# EAGLE design ServoShield_v2 (EAGLE 7.5.0)
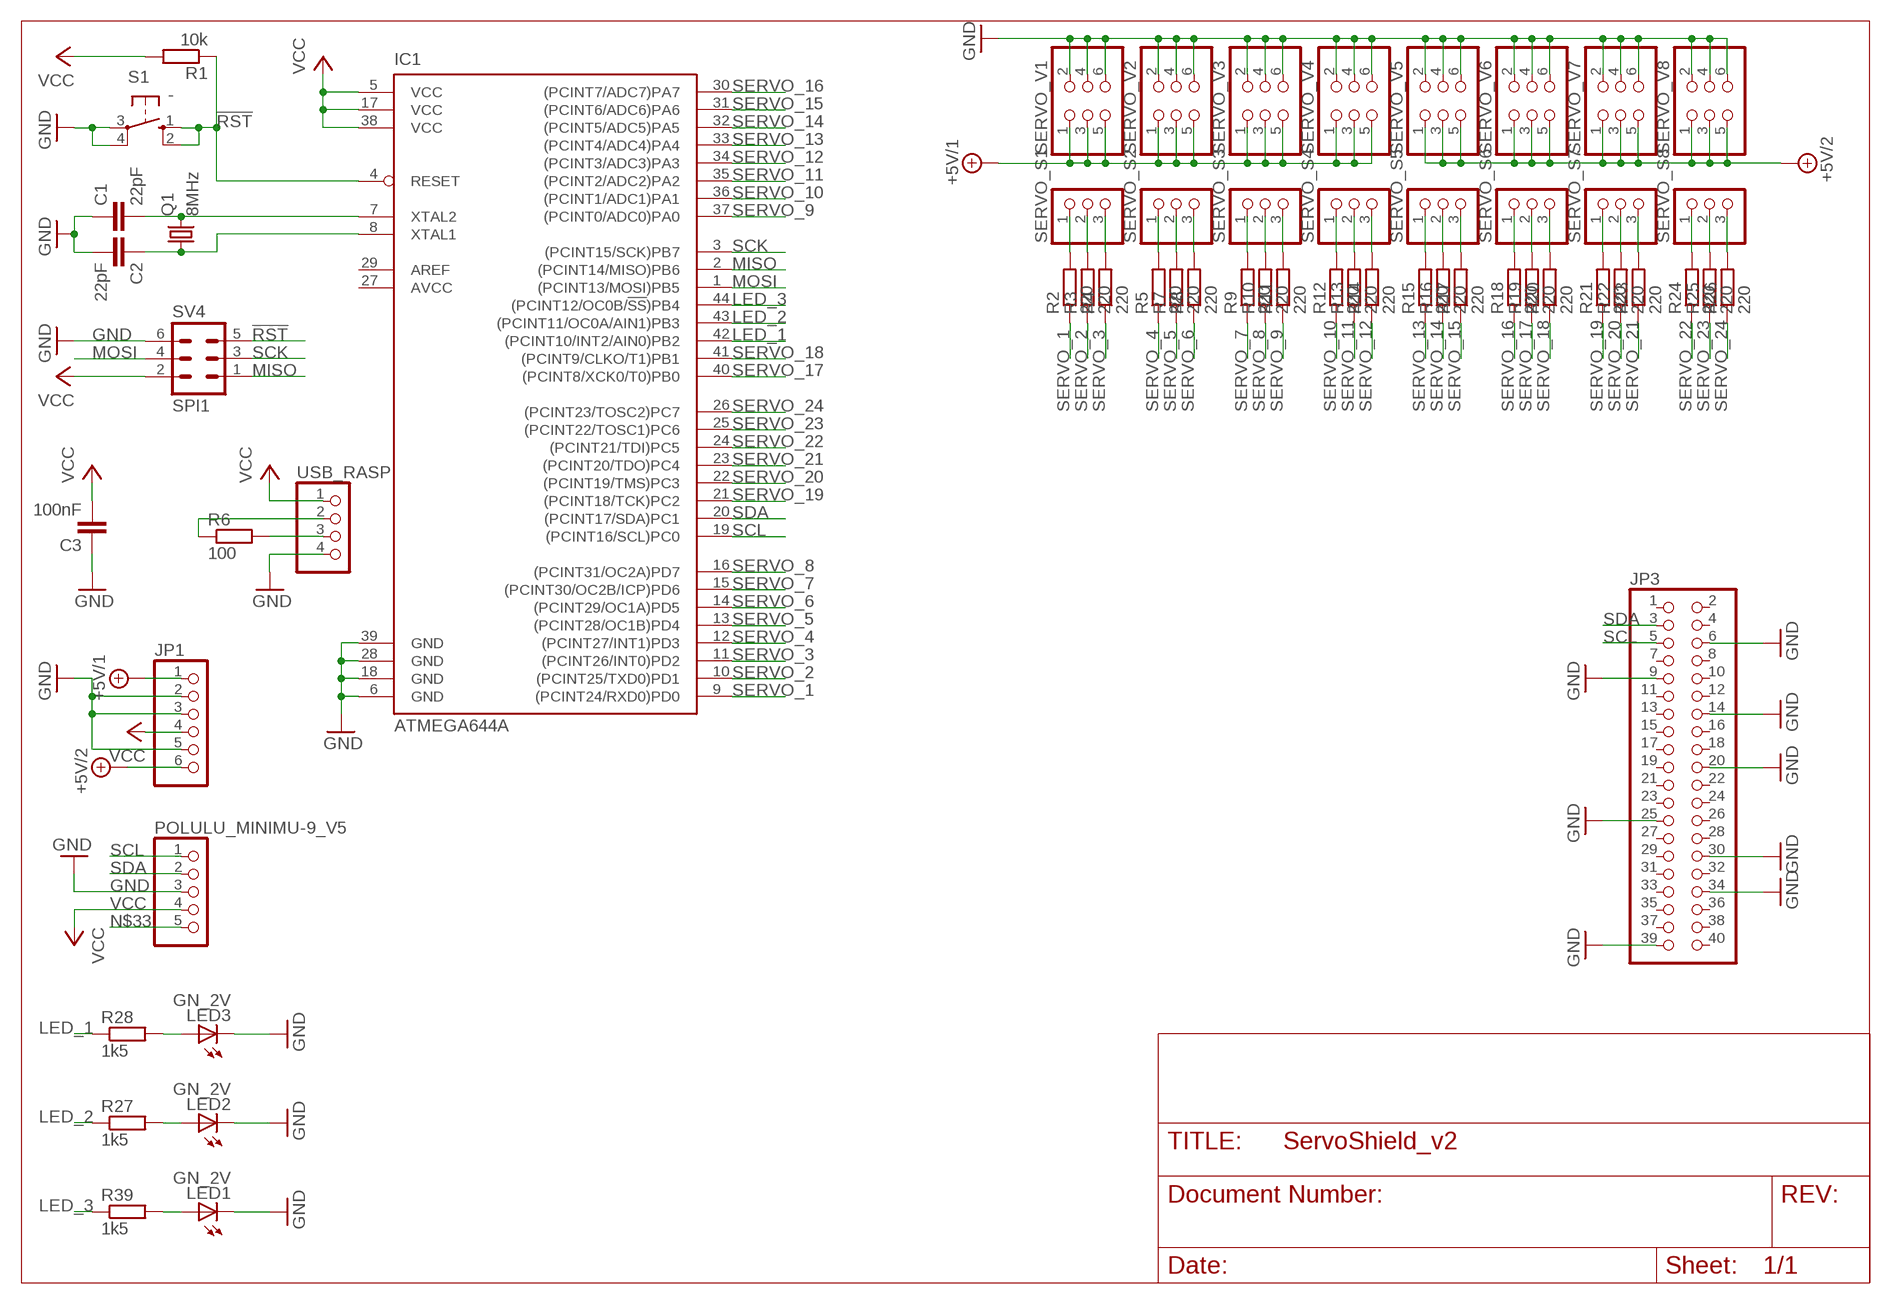
[diagram p0: schematic, sheet 1]

## Parts
C1  22pF  C-EUC0805  [C0805]
C2  22pF  C-EUC0805  [C0805]
C3  100nF  C-EUC0805  [C0805]
IC1  ATMEGA644A  [TQFP44]
JP1  PINHD-1X6  [1X06]
JP3  PINHD-2X20  [2X20]
LED1  GN_2V  LED3MM  [LED3MM]
LED2  GN_2V  LED3MM  [LED3MM]
LED3  GN_2V  LED3MM  [LED3MM]
POLULU_MINIMU-9_V5  PINHD-1X5  [1X05]
Q1  8MHz  CRYSTALCTS406  [CTS406]
R1  10k  R-EU_R0805  [R0805]
R2  220  R-EU_R0805  [R0805]
R3  220  R-EU_R0805  [R0805]
R4  220  R-EU_R0805  [R0805]
R5  220  R-EU_R0805  [R0805]
R6  100  R-EU_R0805  [R0805]
R7  220  R-EU_R0805  [R0805]
R8  220  R-EU_R0805  [R0805]
R9  220  R-EU_R0805  [R0805]
R10  220  R-EU_R0805  [R0805]
R11  220  R-EU_R0805  [R0805]
R12  220  R-EU_R0805  [R0805]
R13  220  R-EU_R0805  [R0805]
R14  220  R-EU_R0805  [R0805]
R15  220  R-EU_R0805  [R0805]
R16  220  R-EU_R0805  [R0805]
R17  220  R-EU_R0805  [R0805]
R18  220  R-EU_R0805  [R0805]
R19  220  R-EU_R0805  [R0805]
R20  220  R-EU_R0805  [R0805]
R21  220  R-EU_R0805  [R0805]
R22  220  R-EU_R0805  [R0805]
R23  220  R-EU_R0805  [R0805]
R24  220  R-EU_R0805  [R0805]
R25  220  R-EU_R0805  [R0805]
R26  220  R-EU_R0805  [R0805]
R27  1k5  R-EU_R0805  [R0805]
R28  1k5  R-EU_R0805  [R0805]
R39  1k5  R-EU_R0805  [R0805]
S1  -  10-XX  [B3F-10XX]
SERVO_S1  PINHD-1X3  [1X03]
SERVO_S2  PINHD-1X3  [1X03]
SERVO_S3  PINHD-1X3  [1X03]
SERVO_S4  PINHD-1X3  [1X03]
SERVO_S5  PINHD-1X3  [1X03]
SERVO_S6  PINHD-1X3  [1X03]
SERVO_S7  PINHD-1X3  [1X03]
SERVO_S8  PINHD-1X3  [1X03]
SERVO_V1  PINHD-2X3  [2X03]
SERVO_V2  PINHD-2X3  [2X03]
SERVO_V3  PINHD-2X3  [2X03]
SERVO_V4  PINHD-2X3  [2X03]
SERVO_V5  PINHD-2X3  [2X03]
SERVO_V6  PINHD-2X3  [2X03]
SERVO_V7  PINHD-2X3  [2X03]
SERVO_V8  PINHD-2X3  [2X03]
SV4  SPI1  ML6  [ML6]
USB_RASP  PINHD-1X4  [1X04]

## Nets
!RST: IC1.4(RESET) R1.1 S1.1(S) S1.2(S1) SV4.5
+5V/1: JP1.1 SERVO_V1.1 SERVO_V1.3 SERVO_V1.5 SERVO_V2.1 SERVO_V2.3 SERVO_V2.5 SERVO_V3.1 SERVO_V3.3 SERVO_V3.5 SERVO_V4.1 SERVO_V4.3 SERVO_V4.5
+5V/2: JP1.6 SERVO_V5.1 SERVO_V5.3 SERVO_V5.5 SERVO_V6.1 SERVO_V6.3 SERVO_V6.5 SERVO_V7.1 SERVO_V7.3 SERVO_V7.5 SERVO_V8.1 SERVO_V8.3 SERVO_V8.5
GND: C1.1 C2.2 C3.1 IC1.6(GND) IC1.18(GND) IC1.28(GND) IC1.39(GND) JP1.2 JP1.3 JP1.5 JP3.6 JP3.9 JP3.14 JP3.20 JP3.25 JP3.30 JP3.34 JP3.39 LED1.K(C) LED2.K(C) LED3.K(C) POLULU_MINIMU-9_V5.3 S1.3(P) S1.4(P1) SERVO_V1.2 SERVO_V1.4 SERVO_V1.6 SERVO_V2.2 SERVO_V2.4 SERVO_V2.6 SERVO_V3.2 SERVO_V3.4 SERVO_V3.6 SERVO_V4.2 SERVO_V4.4 SERVO_V4.6 SERVO_V5.2 SERVO_V5.4 SERVO_V5.6 SERVO_V6.2 SERVO_V6.4 SERVO_V6.6 SERVO_V7.2 SERVO_V7.4 SERVO_V7.6 SERVO_V8.2 SERVO_V8.4 SERVO_V8.6 SV4.6 USB_RASP.4
LED_1: IC1.42((PCINT10/INT2/AIN0)PB2) R28.1
LED_2: IC1.43((PCINT11/OC0A/AIN1)PB3) R27.1
LED_3: IC1.44((PCINT12/OC0B/!SS!)PB4) R39.1
MISO: IC1.2((PCINT14/MISO)PB6) SV4.1
MOSI: IC1.1((PCINT13/MOSI)PB5) SV4.4
N$1: C2.1 IC1.8(XTAL1) Q1.1
N$2: C1.2 IC1.7(XTAL2) Q1.3
N$3: R2.2 SERVO_S1.1
N$4: R3.2 SERVO_S1.2
N$5: R4.2 SERVO_S1.3
N$6: R5.2 SERVO_S2.1
N$7: R7.2 SERVO_S2.2
N$8: R8.2 SERVO_S2.3
N$9: R9.2 SERVO_S3.1
N$10: R10.2 SERVO_S3.2
N$11: R11.2 SERVO_S3.3
N$12: R12.2 SERVO_S4.1
N$13: R13.2 SERVO_S4.2
N$14: R14.2 SERVO_S4.3
N$15: R15.2 SERVO_S5.1
N$16: R16.2 SERVO_S5.2
N$17: R17.2 SERVO_S5.3
N$18: R18.2 SERVO_S6.1
N$19: R19.2 SERVO_S6.2
N$20: R20.2 SERVO_S6.3
N$21: R21.2 SERVO_S7.1
N$22: R22.2 SERVO_S7.2
N$23: R23.2 SERVO_S7.3
N$24: R24.2 SERVO_S8.1
N$25: R25.2 SERVO_S8.2
N$26: R26.2 SERVO_S8.3
N$27: LED2.A R27.2
N$28: LED3.A R28.2
N$33: POLULU_MINIMU-9_V5.5
N$84: R6.2 USB_RASP.3
N$85: LED1.A R39.2
N$86: R6.1 USB_RASP.2
SCK: IC1.3((PCINT15/SCK)PB7) SV4.3
SCL: IC1.19((PCINT16/SCL)PC0) JP3.5 POLULU_MINIMU-9_V5.1
SDA: IC1.20((PCINT17/SDA)PC1) JP3.3 POLULU_MINIMU-9_V5.2
SERVO_1: IC1.9((PCINT24/RXD0)PD0) R2.1
SERVO_2: IC1.10((PCINT25/TXD0)PD1) R3.1
SERVO_3: IC1.11((PCINT26/INT0)PD2) R4.1
SERVO_4: IC1.12((PCINT27/INT1)PD3) R5.1
SERVO_5: IC1.13((PCINT28/OC1B)PD4) R7.1
SERVO_6: IC1.14((PCINT29/OC1A)PD5) R8.1
SERVO_7: IC1.15((PCINT30/OC2B/ICP)PD6) R9.1
SERVO_8: IC1.16((PCINT31/OC2A)PD7) R10.1
SERVO_9: IC1.37((PCINT0/ADC0)PA0) R11.1
SERVO_10: IC1.36((PCINT1/ADC1)PA1) R12.1
SERVO_11: IC1.35((PCINT2/ADC2)PA2) R13.1
SERVO_12: IC1.34((PCINT3/ADC3)PA3) R14.1
SERVO_13: IC1.33((PCINT4/ADC4)PA4) R15.1
SERVO_14: IC1.32((PCINT5/ADC5)PA5) R16.1
SERVO_15: IC1.31((PCINT6/ADC6)PA6) R17.1
SERVO_16: IC1.30((PCINT7/ADC7)PA7) R18.1
SERVO_17: IC1.40((PCINT8/XCK0/T0)PB0) R19.1
SERVO_18: IC1.41((PCINT9/CLKO/T1)PB1) R20.1
SERVO_19: IC1.21((PCINT18/TCK)PC2) R21.1
SERVO_20: IC1.22((PCINT19/TMS)PC3) R22.1
SERVO_21: IC1.23((PCINT20/TDO)PC4) R23.1
SERVO_22: IC1.24((PCINT21/TDI)PC5) R24.1
SERVO_23: IC1.25((PCINT22/TOSC1)PC6) R25.1
SERVO_24: IC1.26((PCINT23/TOSC2)PC7) R26.1
VCC: C3.2 IC1.5(VCC) IC1.17(VCC) IC1.38(VCC) JP1.4 POLULU_MINIMU-9_V5.4 R1.2 SV4.2 USB_RASP.1
Unconnected: IC1.29(AREF) JP3.1 JP3.2 JP3.4 JP3.7 JP3.8 JP3.10 JP3.11 JP3.12 JP3.13 JP3.15 JP3.16 JP3.17 JP3.18 JP3.19 JP3.21 JP3.22 JP3.23 JP3.24 JP3.26 JP3.27 JP3.28 JP3.29 JP3.31 JP3.32 JP3.33 JP3.35 JP3.36 JP3.37 JP3.38 JP3.40

## Power pins joined to a net without a drawn wire
AVCC: IC1.27(AVCC)

## Library data of the parts
C1 C2 = rcl:C-EU: CAPACITOR, European symbol
C3 = resistor:C-EU: CAPACITOR, European symbol
IC1 = atmel:ATMEGA644: 8-bit Microcontroller with 64K Bytes In-System Programmable Flash Source: http://www.atmel.com/dyn/resources/prod_documents/doc2593.pdf; MPN: ATMEGA644PV-10AU; OC_FARNELL: 1455123; OC_NEWARK: 58M3748
JP1 = pinhead:PINHD-1X6: PIN HEADER
JP3 = pinhead:PINHD-2X20: PIN HEADER
LED1-LED3 = led:LED: LED OSRAM: - CHIPLED LG R971, LG N971, LY N971, LG Q971, LY Q971, LO R971, LY R971 LH N974, LH R974 LS Q976, LO Q976, LY Q976 LO Q996 - Hyper CHIPLED LW Q18S LB Q993, LB Q99A, LB R99A - SideLED LS A670, LO A670, LY A670, LG A670, LP A670 LB A673, LV A673, LT A673, LW A673 LH A674 LY A675 LS A676, LA A676, LO A676, LY A676, LW A676 LS A679, LY A679, LG A679 - Hyper Micro SIDELED® LS Y876, LA Y876, LO Y876, LY Y876 LT Y87S - SmartLED LW L88C, LW L88S LB L89C, LB L89S, LG L890 LS L89K, LO L89K, LY L89K LS L896, LA L896, LO L896, LY L896 - TOPLED LS T670, LO T670, LY T670, LG T670, LP T670 LSG T670, LSP T670, LSY T670, LOP T670, LYG T670 LG T671, LOG T671, LSG T671 LB T673, LV T673, LT T673, LW T673 LH T674 LS T676, LA T676, LO T676, LY T676, LB T676, LH T676, LSB T676, LW T676 LB T67C, LV T67C, LT T67C, LS T67K, LO T67K, LY T67K, LW E67C LS E67B, LA E67B, LO E67B, LY E67B, LB E67C, LV E67C, LT E67C LW T67C LS T679, LY T679, LG T679 LS T770, LO T770, LY T770, LG T770, LP T770 LB T773, LV T773, LT T773, LW T773 LH T774 LS E675, LA E675, LY E675, LS T675 LS T776, LA T776, LO T776, LY T776, LB T776 LHGB T686 LT T68C, LB T68C - Hyper Mini TOPLED® LB M676 - Mini TOPLED Santana® LG M470 LS M47K, LO M47K, LY M47K Source: http://www.osram.convergy.de LUXEON: - LUMILED® LXK2-PW12-R00, LXK2-PW12-S00, LXK2-PW14-U00, LXK2-PW14-V00 LXK2-PM12-R00, LXK2-PM12-S00, LXK2-PM14-U00 LXK2-PE12-Q00, LXK2-PE12-R00, LXK2-PE12-S00, LXK2-PE14-T00, LXK2-PE14-U00 LXK2-PB12-K00, LXK2-PB12-L00, LXK2-PB12-M00, LXK2-PB14-N00, LXK2-PB14-P00, LXK2-PB14-Q00 LXK2-PR12-L00, LXK2-PR12-M00, LXK2-PR14-Q00, LXK2-PR14-R00 LXK2-PD12-Q00, LXK2-PD12-R00, LXK2-PD12-S00 LXK2-PH12-R00, LXK2-PH12-S00 LXK2-PL12-P00, LXK2-PL12-Q00, LXK2-PL12-R00 Source: www.luxeon.com KINGBRIGHT: KA-3528ASYC Source: www.kingbright.com
POLULU_MINIMU-9_V5 = pinhead:PINHD-1X5: PIN HEADER
Q1 = crystal:CRYSTAL: CRYSTAL; OC_FARNELL: unknown; OC_NEWARK: unknown
R1-R5 R7-R26 = resistor:R-EU_: RESISTOR, European symbol
R6 R27 R28 R39 = rcl:R-EU_: RESISTOR, European symbol
S1 = switch-omron:10-XX: OMRON SWITCH; MPN: B3F-1000; OC_FARNELL: 176432; OC_NEWARK: 36M3542
SERVO_S1-SERVO_S8 = pinhead_NEW:PINHD-1X3: PIN HEADER
SERVO_V1-SERVO_V8 = pinhead:PINHD-2X3: PIN HEADER
SV4 = con-harting-ml:ML6: HARTING; OC_FARNELL: unknown; OC_NEWARK: unknown
USB_RASP = pinhead:PINHD-1X4: PIN HEADER

## Board
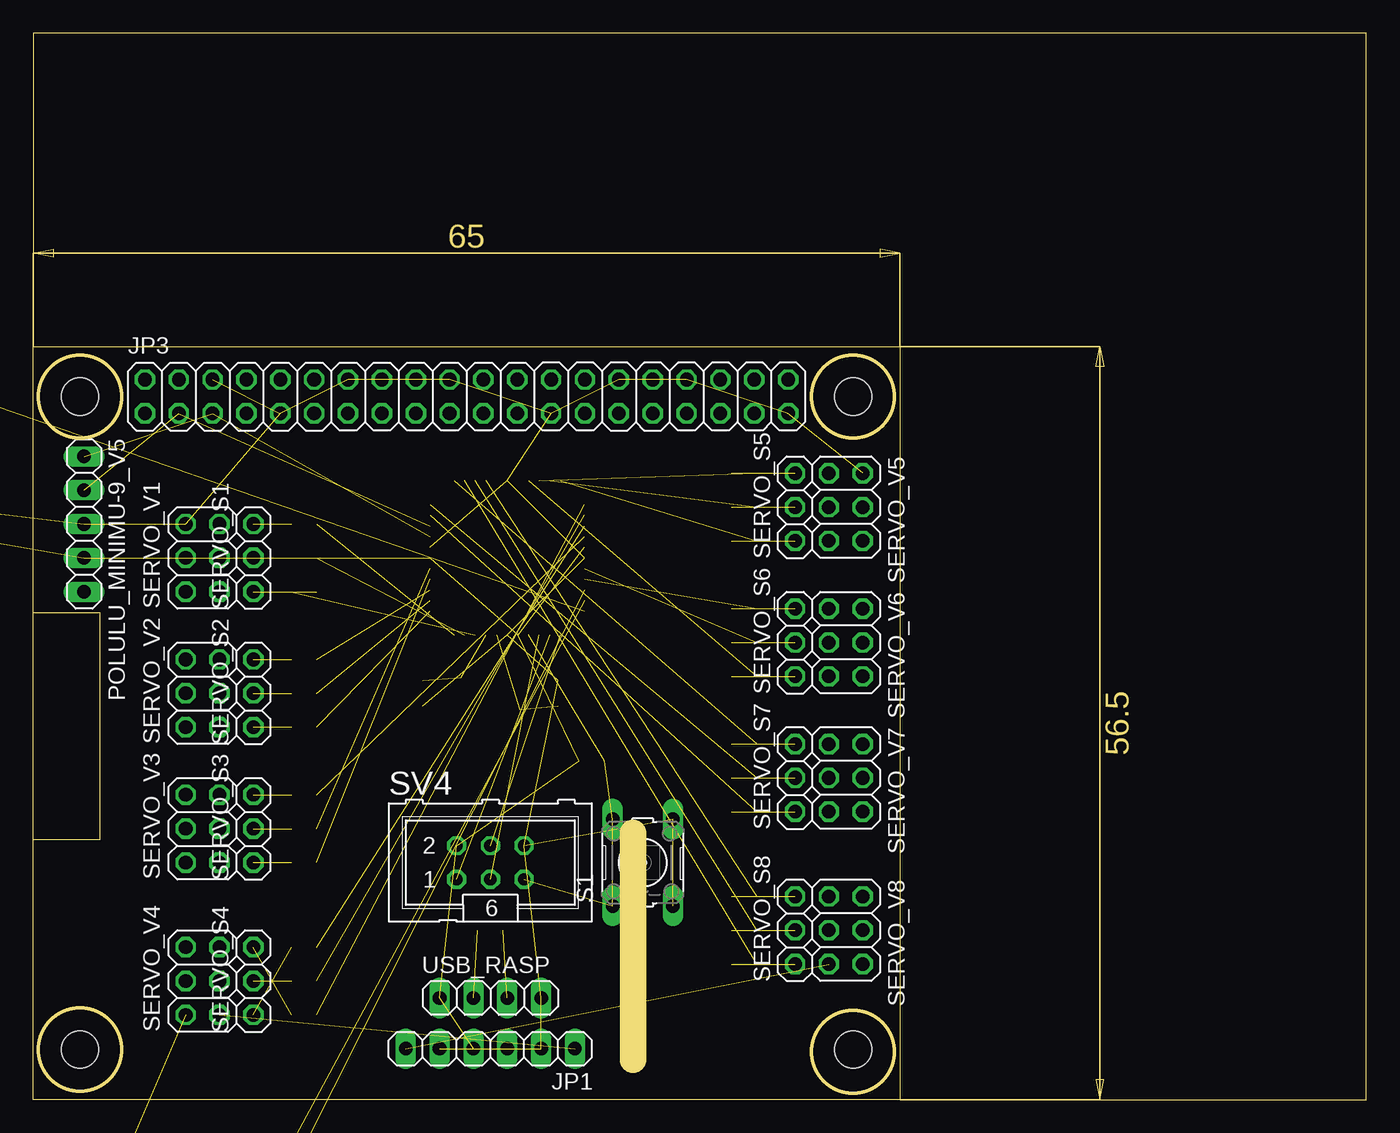
[diagram p1: board, top side]
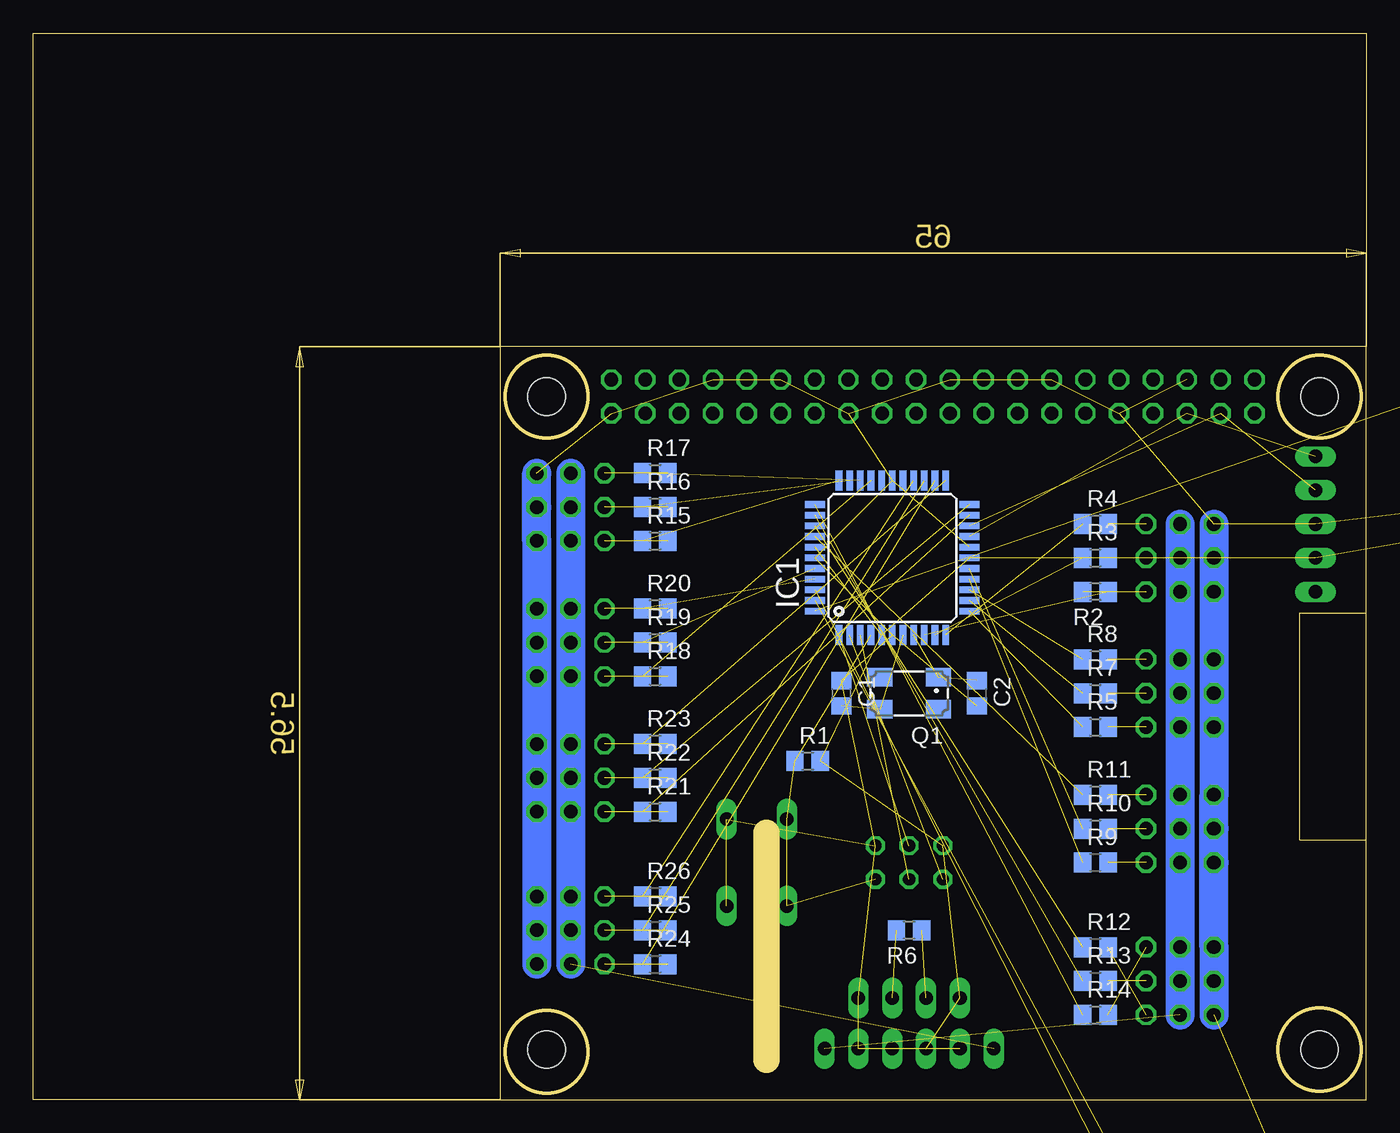
[diagram p2: board, bottom side, seen from below]

Size 100 x 80 mm. Coordinates in mm from the lower left corner, seen from the top.
Outline: 65,0 100,0 100,80 0,80 0,56.5
Outline: 0,19.5 0,0 65,0
Outline: 0,19.5 0,36.5
Outline: 0,36.5 0,56.5
Outline: 0,56.5 65,56.5 65,0
Outline: 45,3 45,20
Outline: 0,36.5 5,36.5 5,19.5 0,19.5
Outline: circle at 3.5,52.75 radius 3.1
Outline: circle at 61.5,52.75 radius 3.1
Outline: circle at 3.5,3.75 radius 3.1
Outline: circle at 61.5,3.57 radius 3.1
Copper layers (1*16): Top 0.035mm / dielectric 1.5mm / Bottom 0.035mm
Design rules "default": minimum track width 10mil, minimum drill 24mil, track to track 8mil, track to pad 8mil, pad to pad 8mil, via to via 8mil, smd to smd 8mil, copper to edge 40mil, drill to drill 8mil, minimum pad ring 10mil, minimum via ring 8mil, stop-mask expansion 4mil, vias tented up to drill 0mil, thermal gap 10mil
Holes 2.8 mm at 3.5,3.75 3.5,52.75 61.5,52.75 61.5,3.75

### Footprints (pad centres in the part's own frame; a part is rotated, then mirrored left to right if it is on the bottom)
C0805 = smd 1.3 x 1.5: 1 -0.95,0; 2 0.95,0
TQFP44 = smd 1.5 x 0.5: 1 -5.8,4; 2 -5.8,3.2; 3 -5.8,2.4; 4 -5.8,1.6; 5 -5.8,0.8; 6 -5.8,0; 7 -5.8,-0.8; 8 -5.8,-1.6; 9 -5.8,-2.4; 10 -5.8,-3.2; 11 -5.8,-4; 23 5.8,-4; 24 5.8,-3.2; 25 5.8,-2.4; 26 5.8,-1.6; 27 5.8,-0.8; 28 5.8,0; 29 5.8,0.8; 30 5.8,1.6; 31 5.8,2.4; 32 5.8,3.2; 33 5.8,4 | smd 0.5 x 1.5: 12 -4,-5.8; 13 -3.2,-5.8; 14 -2.4,-5.8; 15 -1.6,-5.8; 16 -0.8,-5.8; 17 0,-5.8; 18 0.8,-5.8; 19 1.6,-5.8; 20 2.4,-5.8; 21 3.2,-5.8; 22 4,-5.8; 34 4,5.8; 35 3.2,5.8; 36 2.4,5.8; 37 1.6,5.8; 38 0.8,5.8; 39 0,5.8; 40 -0.8,5.8; 41 -1.6,5.8; 42 -2.4,5.8; 43 -3.2,5.8; 44 -4,5.8
1X06 = drill 1.016 long: 1 -6.35,0; 2 -3.81,0; 3 -1.27,0; 4 1.27,0; 5 3.81,0; 6 6.35,0
2X20 = drill 1.016 octagon: 1 -24.13,-1.27; 2 -24.13,1.27; 3 -21.59,-1.27; 4 -21.59,1.27; 5 -19.05,-1.27; 6 -19.05,1.27; 7 -16.51,-1.27; 8 -16.51,1.27; 9 -13.97,-1.27; 10 -13.97,1.27; 11 -11.43,-1.27; 12 -11.43,1.27; 13 -8.89,-1.27; 14 -8.89,1.27; 15 -6.35,-1.27; 16 -6.35,1.27; 17 -3.81,-1.27; 18 -3.81,1.27; 19 -1.27,-1.27; 20 -1.27,1.27; 21 1.27,-1.27; 22 1.27,1.27; 23 3.81,-1.27; 24 3.81,1.27; 25 6.35,-1.27; 26 6.35,1.27; 27 8.89,-1.27; 28 8.89,1.27; 29 11.43,-1.27; 30 11.43,1.27; 31 13.97,-1.27; 32 13.97,1.27; 33 16.51,-1.27; 34 16.51,1.27; 35 19.05,-1.27; 36 19.05,1.27; 37 21.59,-1.27; 38 21.59,1.27; 39 24.13,-1.27; 40 24.13,1.27
LED3MM = drill 0.813 octagon: A -1.27,0; K 1.27,0
1X05 = drill 1.016 long: 1 -5.08,0; 2 -2.54,0; 3 0,0; 4 2.54,0; 5 5.08,0
CTS406 = smd 1.9 x 1.4: 1 -2.2,-1.2; 2 2.2,-1.2; 3 2.2,1.2; 4 -2.2,1.2
R0805 = smd 1.3 x 1.5: 1 -0.95,0; 2 0.95,0
B3F-10XX = drill 1.016 long: 1 -3.251,2.261; 2 3.251,2.261; 3 -3.251,-2.261; 4 3.251,-2.261
1X03 = drill 1.016 octagon: 1 -2.54,0; 2 0,0; 3 2.54,0
2X03 = drill 1.016 octagon: 1 -2.54,-1.27; 2 -2.54,1.27; 3 0,-1.27; 4 0,1.27; 5 2.54,-1.27; 6 2.54,1.27
ML6 = drill 0.914 octagon: 1 -2.54,-1.27; 2 -2.54,1.27; 3 0,-1.27; 4 0,1.27; 5 2.54,-1.27; 6 2.54,1.27
1X04 = drill 1.016 long: 1 -3.81,0; 2 -1.27,0; 3 1.27,0; 4 3.81,0

### Placement (x,y rotation side)
C1  39.37,30.48 270 bottom
C2  29.21,30.48 270 bottom
C3  -48.26,49.53 0 top  (outside the outline)
IC1  35.56,40.64 90 bottom
JP1  34.29,3.81 180 top
JP3  32.5,52.75 0 top
LED1  -50.8,68.58 0 top  (outside the outline)
LED2  -62.23,-162.56 0 top  (outside the outline)
LED3  -62.23,-175.26 0 top  (outside the outline)
POLULU_MINIMU-9_V5  3.81,43.18 270 top
Q1  34.29,30.48 180 bottom
R1  41.91,25.4 0 bottom
R2  20.32,38.1 180 bottom
R3  20.32,40.64 0 bottom
R4  20.32,43.18 0 bottom
R5  20.32,27.94 0 bottom
R6  34.29,12.7 180 bottom
R7  20.32,30.48 0 bottom
R8  20.32,33.02 0 bottom
R9  20.32,17.78 0 bottom
R10  20.32,20.32 0 bottom
R11  20.32,22.86 0 bottom
R12  20.32,11.43 0 bottom
R13  20.32,8.89 0 bottom
R14  20.32,6.35 0 bottom
R15  53.34,41.91 0 bottom
R16  53.34,44.45 0 bottom
R17  53.34,46.99 0 bottom
R18  53.34,31.75 0 bottom
R19  53.34,34.29 0 bottom
R20  53.34,36.83 0 bottom
R21  53.34,21.59 0 bottom
R22  53.34,24.13 0 bottom
R23  53.34,26.67 0 bottom
R24  53.34,10.16 0 bottom
R25  53.34,12.7 0 bottom
R26  53.34,15.24 0 bottom
R27  -62.23,-156.21 0 top  (outside the outline)
R28  -62.23,-168.91 0 top  (outside the outline)
R39  -16.51,57.15 0 top  (outside the outline)
S1  45.72,17.78 90 top
SERVO_S1  16.51,40.64 90 top
SERVO_S2  16.51,30.48 90 top
SERVO_S3  16.51,20.32 90 top
SERVO_S4  16.51,8.89 90 top
SERVO_S5  57.15,44.45 90 top
SERVO_S6  57.15,34.29 90 top
SERVO_S7  57.15,24.13 90 top
SERVO_S8  57.15,12.7 90 top
SERVO_V1  12.7,40.64 90 top
SERVO_V2  12.7,30.48 90 top
SERVO_V3  12.7,20.32 90 top
SERVO_V4  12.7,8.89 90 top
SERVO_V5  60.96,44.45 270 top
SERVO_V6  60.96,34.29 270 top
SERVO_V7  60.96,24.13 270 top
SERVO_V8  60.96,12.7 270 top
SV4  34.29,17.78 0 top
USB_RASP  34.29,7.62 0 top

### Tracks (layer width: path | path; a pad name or v marks a point on that pad's centre or on a via)
!RST  (4 unrouted)
+5V/1  (1 unrouted)
  Bottom 2.184: SERVO_V1.5 SERVO_V1.3 SERVO_V1.1 SERVO_V2.5 SERVO_V2.3 SERVO_V2.1 SERVO_V3.5 SERVO_V3.3 SERVO_V3.1 SERVO_V4.5 SERVO_V4.3 SERVO_V4.1
+5V/2  (1 unrouted)
  Bottom 2.184: SERVO_V5.1 SERVO_V5.3 SERVO_V5.5 SERVO_V6.1 SERVO_V6.3 SERVO_V6.5 SERVO_V7.1 SERVO_V7.3 SERVO_V7.5 SERVO_V8.1 SERVO_V8.3 SERVO_V8.5
GND  (27 unrouted)
  Bottom 2.184: SERVO_V1.6 SERVO_V1.4 SERVO_V1.2 SERVO_V2.6 SERVO_V2.4 SERVO_V2.2 SERVO_V3.6 SERVO_V3.4 SERVO_V3.2 SERVO_V4.6 SERVO_V4.4 SERVO_V4.2 | SERVO_V5.2 SERVO_V5.4 SERVO_V5.6 SERVO_V6.2 SERVO_V6.4 SERVO_V6.6 SERVO_V7.2 SERVO_V7.4 SERVO_V7.6 SERVO_V8.2 SERVO_V8.4 SERVO_V8.6
LED_1  (1 unrouted)
LED_2  (1 unrouted)
LED_3  (1 unrouted)
MISO  (1 unrouted)
MOSI  (1 unrouted)
N$1  (2 unrouted)
N$2  (2 unrouted)
N$3  (1 unrouted)
N$4  (1 unrouted)
N$5  (1 unrouted)
N$6  (1 unrouted)
N$7  (1 unrouted)
N$8  (1 unrouted)
N$9  (1 unrouted)
N$10  (1 unrouted)
N$11  (1 unrouted)
N$12  (1 unrouted)
N$13  (1 unrouted)
N$14  (1 unrouted)
N$15  (1 unrouted)
N$16  (1 unrouted)
N$17  (1 unrouted)
N$18  (1 unrouted)
N$19  (1 unrouted)
N$20  (1 unrouted)
N$21  (1 unrouted)
N$22  (1 unrouted)
N$23  (1 unrouted)
N$24  (1 unrouted)
N$25  (1 unrouted)
N$26  (1 unrouted)
N$27  (1 unrouted)
N$28  (1 unrouted)
N$84  (1 unrouted)
N$85  (1 unrouted)
N$86  (1 unrouted)
SCK  (1 unrouted)
SCL  (2 unrouted)
SDA  (2 unrouted)
SERVO_1  (1 unrouted)
SERVO_2  (1 unrouted)
SERVO_3  (1 unrouted)
SERVO_4  (1 unrouted)
SERVO_5  (1 unrouted)
SERVO_6  (1 unrouted)
SERVO_7  (1 unrouted)
SERVO_8  (1 unrouted)
SERVO_9  (1 unrouted)
SERVO_10  (1 unrouted)
SERVO_11  (1 unrouted)
SERVO_12  (1 unrouted)
SERVO_13  (1 unrouted)
SERVO_14  (1 unrouted)
SERVO_15  (1 unrouted)
SERVO_16  (1 unrouted)
SERVO_17  (1 unrouted)
SERVO_18  (1 unrouted)
SERVO_19  (1 unrouted)
SERVO_20  (1 unrouted)
SERVO_21  (1 unrouted)
SERVO_22  (1 unrouted)
SERVO_23  (1 unrouted)
SERVO_24  (1 unrouted)
VCC  (8 unrouted)